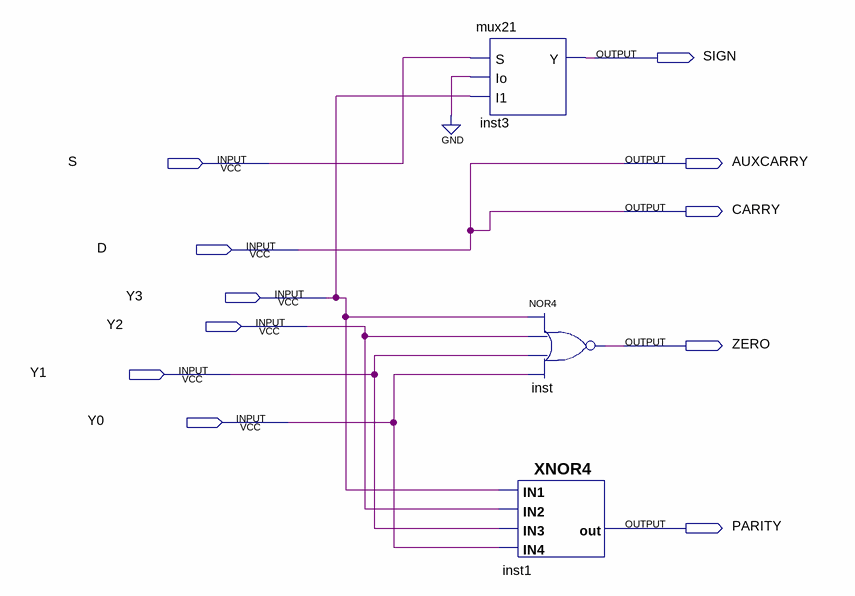
[diagram p0: schematic sheet]
// Quartus schematic Flags.bdf as structural Verilog: 3 symbols, 11 pins
module Flags (
  input  S,
  input  D,
  input  Y3,
  input  Y2,
  input  Y1,
  input  Y0,
  output SIGN,
  output AUXCARRY,
  output CARRY,
  output ZERO,
  output PARITY
);

  mux21 inst3 (.S(S), .Io(1'b0), .I1(Y3), .Y(SIGN));
  nor inst (ZERO, Y3, Y2, Y1, Y0);
  XNOR4 inst1 (.IN4(Y0), .IN2(Y2), .IN3(Y1), .IN1(Y3), .out(PARITY));

  assign AUXCARRY = D;
  assign CARRY = D;
endmodule
